# EAGLE design MIDI_TRIGGER_SDSV (EAGLE 7.4.0)
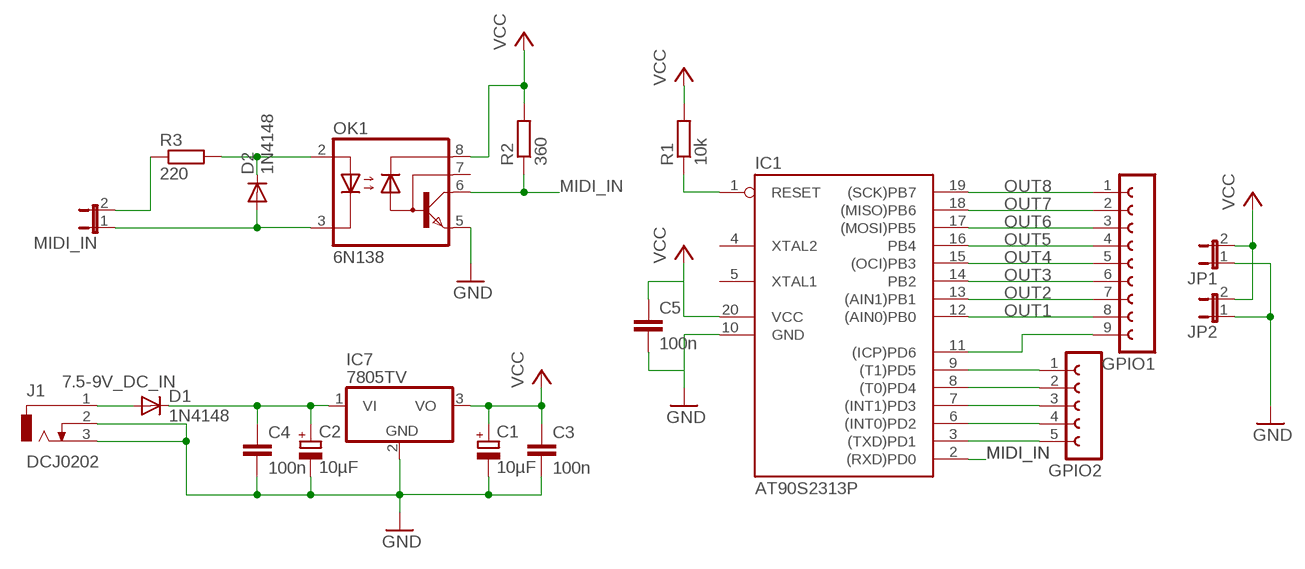
[diagram p0: schematic, sheet 1]

## Parts
C1  10µF  CPOL-EUE5-8.5  [E5-8,5]
C2  10µF  CPOL-EUE5-8.5  [E5-8,5]
C3  100n  C-EU050-025X075  [C050-025X075]
C4  100n  C-EU050-025X075  [C050-025X075]
C5  100n  C-EU050-025X075  [C050-025X075]
D1  1N4148  1N4148DO35-7  [DO35-7]
D2  1N4148  1N4148DO35-7  [DO35-7]
GPIO1  FE09-1  [FE09]
GPIO2  FE05-1  [FE05-1]
IC1  AT90S2313P  [DIL20]
IC7  7805TV  [TO220V]
J1  DCJ0202  [DCJ0202]
JP1  JP1E  [JP1]
JP2  JP1E  [JP1]
MIDI_IN  JP1E  [JP1]
OK1  6N138  6N135  [DIL08]
R1  10k  R-EU_0204/7  [0204/7]
R2  360  R-EU_0204/7  [0204/7]
R3  220  R-EU_0204/7  [0204/7]

## Nets
7.5-9V_DC_IN: D1.A J1.1
GND: C1.- C2.- C3.2 C4.2 C5.2 IC1.10(GND) IC7.2(GND) J1.2 J1.3 JP1.1 JP2.1 OK1.5(GND)
MIDI_IN: IC1.2((RXD)PD0) OK1.6(VO) R2.1
N$1: GPIO1.9 IC1.11((ICP)PD6)
N$2: GPIO2.1 IC1.9((T1)PD5)
N$3: GPIO2.2 IC1.8((T0)PD4)
N$4: C2.+ C4.1 D1.C IC7.1(VI)
N$5: GPIO2.3 IC1.7((INT1)PD3)
N$6: GPIO2.4 IC1.6((INT0)PD2)
N$7: GPIO2.5 IC1.3((TXD)PD1)
N$10: IC1.1(RESET) R1.1
N$31: MIDI_IN.2 R3.1
N$32: D2.C OK1.2(A) R3.2
N$33: D2.A MIDI_IN.1 OK1.3(C)
OUT1: GPIO1.8 IC1.12((AIN0)PB0)
OUT2: GPIO1.7 IC1.13((AIN1)PB1)
OUT3: GPIO1.6 IC1.14(PB2)
OUT4: GPIO1.5 IC1.15((OCI)PB3)
OUT5: GPIO1.4 IC1.16(PB4)
OUT6: GPIO1.3 IC1.17((MOSI)PB5)
OUT7: GPIO1.2 IC1.18((MISO)PB6)
OUT8: GPIO1.1 IC1.19((SCK)PB7)
VCC: C1.+ C3.1 C5.1 IC1.20(VCC) IC7.3(VO) JP1.2 JP2.2 OK1.8(VCC) R1.2 R2.2
Unconnected: IC1.4(XTAL2) IC1.5(XTAL1) OK1.7(VB)

## Library data of the parts
C1 C2 = resistor:CPOL-EU: POLARIZED CAPACITOR, European symbol
C3-C5 = rcl:C-EU: CAPACITOR, European symbol
D1 D2 = diode:1N4148: DIODE high speed (Philips)
GPIO1 = con-lsta:FE09-1: FEMALE HEADER; OC_FARNELL: unknown; OC_NEWARK: unknown
GPIO2 = con-lsta:FE05-1: FEMALE HEADER; OC_FARNELL: unknown; OC_NEWARK: unknown
IC1 = atmel:AT90S2313: MICROCONTROLLER 2 Kbytes FLASH 128 bytes SRAM 128 bytes EEPROM UART; OC_FARNELL: unknown; OC_NEWARK: unknown
IC7 = linear:78*: Positive VOLTAGE REGULATOR Source: http://cache.national.com/ds/LM/LM78L05.pdf http://www.fairchildsemi.com/ds/LM/LM7805.pdf
J1 = con-jack:DCJ0202: DC POWER JACK Source: DCJ0202.pdf; OC_FARNELL: unknown; OC_NEWARK: unknown
JP1 JP2 MIDI_IN = jumper:JP1E: JUMPER
OK1 = optocoupler:6N135: MOTOROLA OPTO COUPLER; MF: FAIRCHILD SEMICONDUCTOR; MPN: 6N135; OC_FARNELL: 1021342; OC_NEWARK: 58K9658
R1-R3 = resistor:R-EU_: RESISTOR, European symbol

## Board
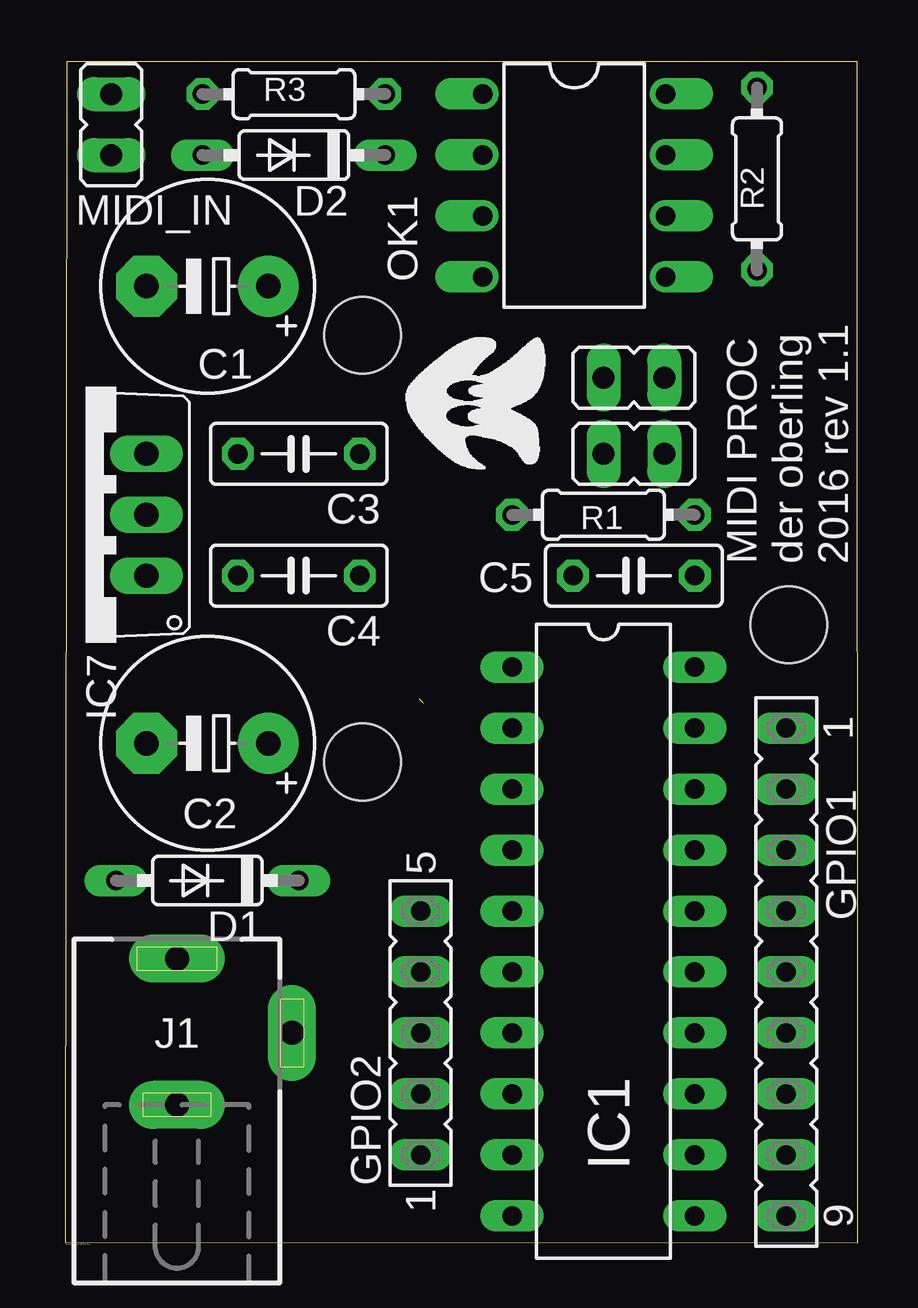
[diagram p1: board, top side]
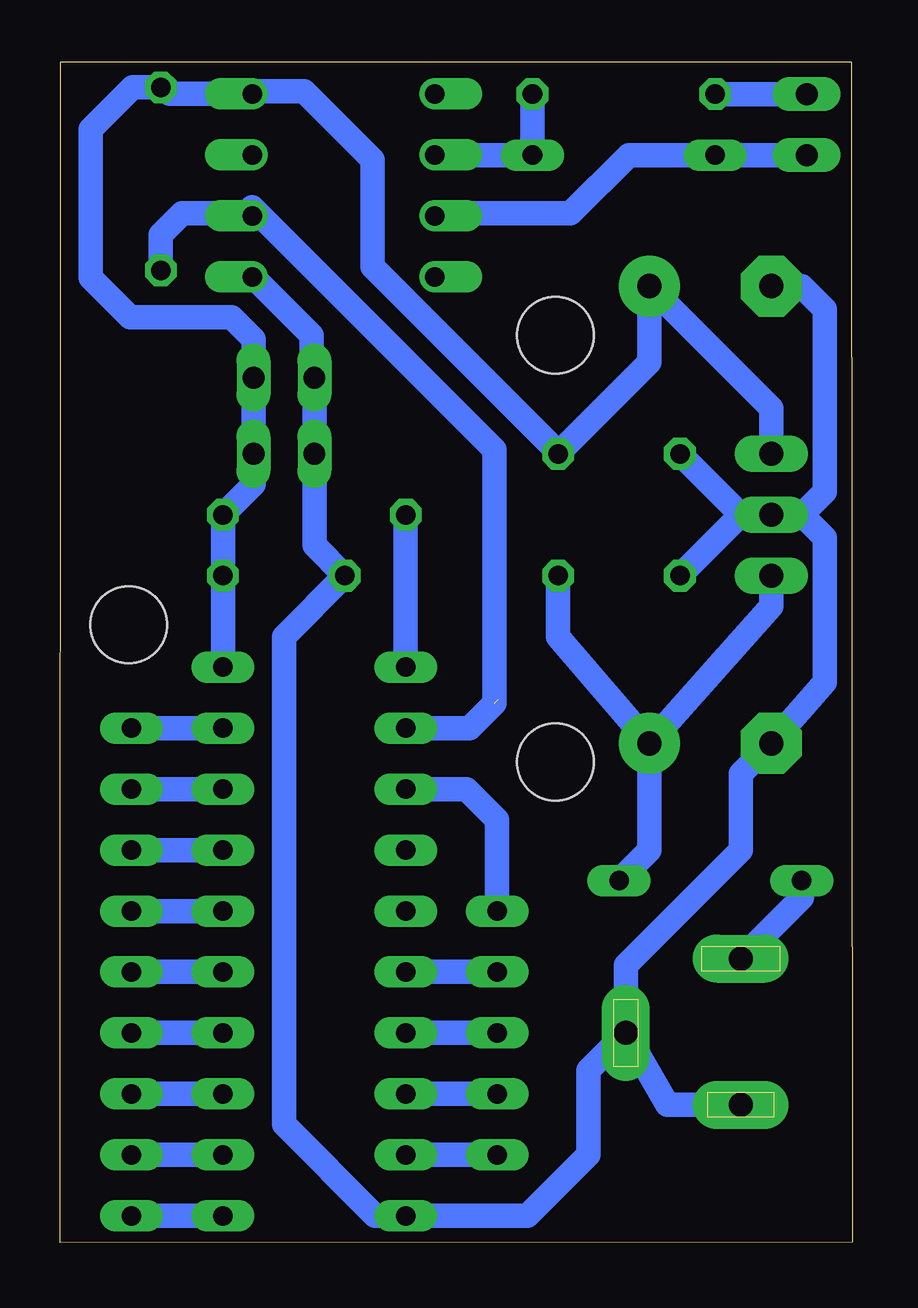
[diagram p2: board, bottom side, seen from below]

Size 33.03 x 49.2 mm. Coordinates in mm from the lower left corner, seen from the top.
Outline: 0,0.03 33.03,0 33.01,49.2 0.05,49.2 0,0.03
Copper layers (1*16): Top 0.035mm / dielectric 1.5mm / Bottom 0.035mm
Design rules "SMART_PROTOTYPING_NOA Eagle Rule 2016-06-12": minimum track width 6mil, minimum drill 0.3mm, track to track 6mil, track to pad 6mil, pad to pad 6mil, via to via 6mil, smd to smd 0mil, copper to edge 0.4mm, drill to drill 10mil, minimum pad ring 10mil, minimum via ring 6mil, stop-mask expansion 2mil, vias tented up to drill 25mil, thermal gap 10mil
Holes 3.2 mm at 12.38,37.81 30.16,25.74 12.38,20.03

### Footprints (pad centres in the part's own frame; a part is rotated, then mirrored left to right if it is on the bottom)
E5-8,5 = drill 1.016 pad 2.54: + -2.54,0 | drill 1.016 pad 2.54 octagon: - 2.54,0
C050-025X075 = drill 0.813 octagon: 1 -2.54,0; 2 2.54,0
DO35-7 = drill 0.813 long: A 3.81,0; C -3.81,0
FE09 = drill 0.813 long: 1 -10.16,0; 2 -7.62,0; 3 -5.08,0; 4 -2.54,0; 5 0,0; 6 2.54,0; 7 5.08,0; 8 7.62,0; 9 10.16,0
FE05-1 = drill 0.813 long: 1 -5.08,0; 2 -2.54,0; 3 0,0; 4 2.54,0; 5 5.08,0
DIL20 = drill 0.813 long: 1 -11.43,-3.81; 2 -8.89,-3.81; 3 -6.35,-3.81; 4 -3.81,-3.81; 5 -1.27,-3.81; 6 1.27,-3.81; 7 3.81,-3.81; 8 6.35,-3.81; 9 8.89,-3.81; 10 11.43,-3.81; 11 11.43,3.81; 12 8.89,3.81; 13 6.35,3.81; 14 3.81,3.81; 15 1.27,3.81; 16 -1.27,3.81; 17 -3.81,3.81; 18 -6.35,3.81; 19 -8.89,3.81; 20 -11.43,3.81
TO220V = drill 1.016 long: 1 -2.54,-2.54; 2 0,-2.54; 3 2.54,-2.54
DCJ0202 = drill 1 pad 2 long: 1 0,3.1; 2 4.8,0; 3 0,-3
JP1 = drill 0.914 long: 1 0,-1.27; 2 0,1.27
DIL08 = drill 0.813 offset: 1 -3.81,-3.81; 2 -1.27,-3.81; 3 1.27,-3.81; 4 3.81,-3.81; 5 3.81,3.81; 6 1.27,3.81; 7 -1.27,3.81; 8 -3.81,3.81
0204/7 = drill 0.813 octagon: 1 -3.81,0; 2 3.81,0

### Placement (x,y rotation side)
C1  5.92,39.85 180 top
C2  5.92,20.8 180 top
C3  9.73,32.87 180 top
C4  9.73,27.79 180 top
C5  23.7,27.79 180 top
D1  5.92,15.09 180 top
D2  9.53,45.31 180 top
GPIO1  30.05,11.28 270 top
GPIO2  14.81,8.74 90 top
IC1  22.43,12.55 270 top
IC7  0.84,30.33 90 top
J1  4.65,8.74 0 top
JP1  23.7,32.87 270 top
JP2  23.7,36.04 270 top
MIDI_IN  1.91,46.58 0 top
OK1  21.21,44.05 270 top
R1  22.43,30.33 0 top
R2  28.83,44.32 90 top
R3  9.53,47.85 0 top

### Tracks (layer width: path | path; a pad name or v marks a point on that pad's centre or on a via)
7.5-9V_DC_IN
  Bottom 1.016: D1.A 2.11,14.38 J1.1
GND
  Bottom 1.016: J1.3 7.72,5.74 J1.2 | 2.11,30.33 1.16,29.38 1.16,23.34 C2.- 4.65,19.53 4.65,16.36 9.45,11.56 J1.2 | 2.11,30.33 IC7.2 4.65,30.33 | C1.- 2.11,39.85 1.16,38.9 1.16,31.28 2.11,30.33 | 4.65,30.33 C3.2 | 4.65,30.33 C4.2 | J1.2 11,7.19 11,3.66 13.54,1.12 IC1.10 19.89,1.12 23.7,4.93 23.7,25.25 C5.2 22.43,29.06 JP1.1 JP2.1 22.54,36.16 22.54,37.81 25.02,40.28 OK1.5
MIDI_IN  (1 unrouted)
  Bottom 1.016: IC1.2 15.95,21.44 14.92,22.47 14.92,33.05 25.02,43.14 OK1.6 25.13,42.89 27.94,42.89 28.83,42 R2.1
N$1
  Bottom 1.016: IC1.11 GPIO1.9
N$2
  Bottom 1.016: GPIO2.1 IC1.9
N$3
  Bottom 1.016: GPIO2.2 IC1.8
N$4
  Bottom 1.016: IC7.1 3.38,26.52 C2.+ | C4.1 12.27,25.25 C2.+ | D1.C 8.46,16.36 C2.+
N$5
  Bottom 1.016: GPIO2.3 IC1.7
N$6
  Bottom 1.016: GPIO2.4 IC1.6
N$7
  Bottom 1.016: IC1.3 16.08,18.9 14.81,17.63 GPIO2.5
N$10
  Bottom 1.016: R1.1 IC1.1
N$31
  Bottom 1.016: MIDI_IN.2 R3.1
N$32
  Bottom 1.016: R3.2 D2.C OK1.2
N$33
  Bottom 1.016: MIDI_IN.1 D2.A 9.32,45.31 11.75,42.89 17.29,42.89 OK1.3
OUT1
  Bottom 1.016: IC1.12 GPIO1.8
OUT2
  Bottom 1.016: IC1.13 GPIO1.7
OUT3
  Bottom 1.016: IC1.14 GPIO1.6
OUT4
  Bottom 1.016: IC1.15 GPIO1.5
OUT5
  Bottom 1.016: IC1.16 GPIO1.4
OUT6
  Bottom 1.016: IC1.17 GPIO1.3
OUT7
  Bottom 1.016: IC1.18 GPIO1.2
OUT8
  Bottom 1.016: IC1.19 GPIO1.1
VCC
  Bottom 1.016: IC7.3 3.38,34.77 C1.+ 8.46,36.68 C3.1 12.27,32.93 20,40.67 20,45.11 22.86,47.97 24.91,47.97 OK1.8 28.47,47.86 R2.2 30,48.13 31.75,46.38 31.75,40.21 30.1,38.56 25.88,38.56 24.97,37.64 JP2.2 JP1.2 24.97,31.6 R1.2 C5.1 IC1.20

### Text on the board
tPlace: MIDI PROC / der oberling / 2016 rev 1.1 | /home/oberling/eagle/logo.bmp